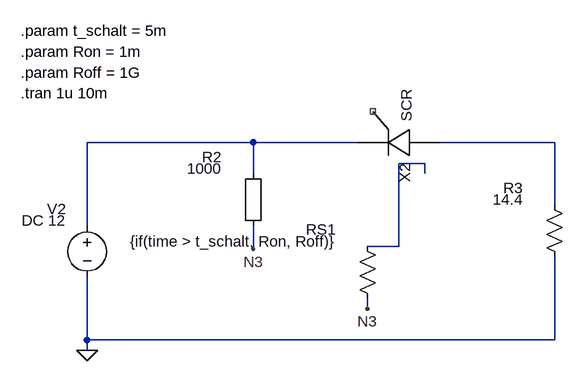
[diagram p0: schematic 11_1_1_Thyristor_als_Gleichstromschalter_1_test.asc]
11_1_1_Thyristor_als_Gleichstromschalter_1_test.asc, the LTspice schematic file:
Version 4
SHEET 1 880 680
WIRE 112 592 112 576
WIRE 112 576 112 480
WIRE 112 576 832 576
WIRE 832 576 832 464
WIRE 832 464 832 448
WIRE 368 436 368 400
WIRE 544 528 544 512
WIRE 528 272 368 272
WIRE 368 272 112 272
WIRE 112 272 112 400
WIRE 368 272 368 320
WIRE 632 320 632 304
WIRE 632 304 592 304
WIRE 592 304 592 432
WIRE 592 432 544 432
WIRE 656 272 832 272
WIRE 832 272 832 368
FLAG 112 592 0
FLAG 368 436 N3
FLAG 544 528 N3
SYMBOL SCR 592 272 M270
WINDOW 0 -32 -10 Right 2
SYMATTR InstName X2
SYMATTR Value SCR
SYMATTR LibreSpice pins=A,G,K
SYMBOL voltage 112 384 R0
WINDOW 0 -32 -10 Right 2
WINDOW 3 -32 8 Right 2
SYMATTR InstName V2
SYMATTR Value DC 12
SYMBOL res 528 416 R0
WINDOW 0 -32 -10 Right 2
WINDOW 3 -32 8 Right 2
SYMATTR InstName RS1
SYMATTR Value {if(time > t_schalt, Ron, Roff)}
SYMBOL Misc\EuropeanResistor 352 304 R0
WINDOW 0 -32 -10 Right 2
WINDOW 3 -32 8 Right 2
SYMATTR InstName R2
SYMATTR Value 1000
SYMBOL res 816 352 R0
WINDOW 0 -32 -10 Right 2
WINDOW 3 -32 8 Right 2
SYMATTR InstName R3
SYMATTR Value 14.4
TEXT 10 100 Left 2 !.param t_schalt = 5m
TEXT 10 132 Left 2 !.param Ron = 1m
TEXT 10 164 Left 2 !.param Roff = 1G
TEXT 10 196 Left 2 !.tran 1u 10m

The netlist it stands for:
* 11_1_1_Thyristor_als_Gleichstromschalter_1_test.asc
XX2 N003 NC_01 N001 SCR SCR  ; pins A G K
V2 N001 0 DC 12
RS1 N002 N3 {if(time > t_schalt, Ron, Roff)}
R2 N001 N3 1000
R3 N003 0 14.4
.param t_schalt = 5m
.param Ron = 1m
.param Roff = 1G
.tran 1u 10m
.backanno
.end